# Altium schematic sheet 15_LCD.SchDoc
size A4
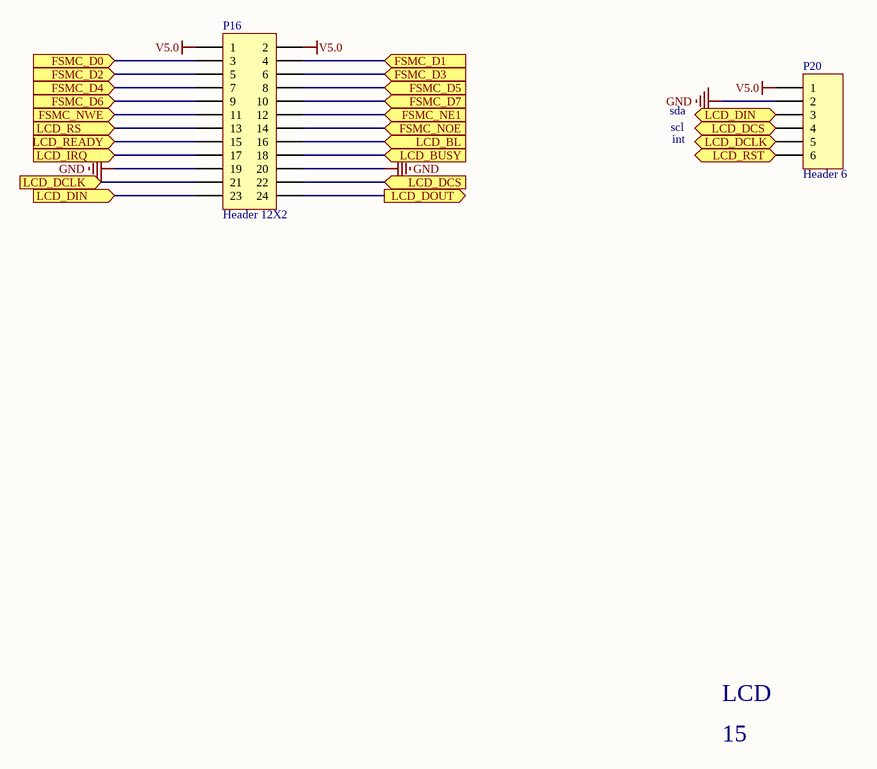
[diagram p0: 15_LCD.SchDoc]

## Parts
P16  Header 12X2  [HDR2X12]
P20  Header 6  [HDR1X6]

## Ports
FSMC_D0 (in), FSMC_D1 (in), FSMC_D2 (in), FSMC_D3 (in), FSMC_D4 (in), FSMC_D5 (in), FSMC_D6 (in), FSMC_D7 (in), FSMC_NE1 (in), FSMC_NOE (in), FSMC_NWE (in), LCD_BL (in), LCD_BUSY (in), LCD_DCLK (in), LCD_DCS (in), LCD_DIN (in), LCD_DOUT (out), LCD_IRQ (in), LCD_READY (in), LCD_RS (in), LCD_RST (in)

## Nets
GND: P16.19 P16.20 P20.2
V5.0: P16.1 P16.2 P20.1
FSMC_D0: P16.3 ; port FSMC_D0
FSMC_D1: P16.4 ; port FSMC_D1
FSMC_D2: P16.5 ; port FSMC_D2
FSMC_D3: P16.6 ; port FSMC_D3
FSMC_D4: P16.7 ; port FSMC_D4
FSMC_D5: P16.8 ; port FSMC_D5
FSMC_D6: P16.9 ; port FSMC_D6
FSMC_D7: P16.10 ; port FSMC_D7
FSMC_NE1: P16.12 ; port FSMC_NE1
FSMC_NOE: P16.14 ; port FSMC_NOE
FSMC_NWE: P16.11 ; port FSMC_NWE
LCD_BL: P16.16 ; port LCD_BL
LCD_BUSY: P16.18 ; port LCD_BUSY
LCD_DCLK: P16.21 P20.5 ; port LCD_DCLK
LCD_DCS: P16.22 P20.4 ; port LCD_DCS
LCD_DIN: P16.23 P20.3 ; port LCD_DIN
LCD_DOUT: P16.24 ; port LCD_DOUT
LCD_IRQ: P16.17 ; port LCD_IRQ
LCD_READY: P16.15 ; port LCD_READY
LCD_RS: P16.13 ; port LCD_RS
LCD_RST: P20.6 ; port LCD_RST

## Notes on the sheet
- sda
- scl
- int
- LCD
- 15

## Library data of the parts
P16 = Header 12X2: Header, 12-Pin, Dual row; LatestRevisionDate: 17-Jul-2002; LatestRevisionNote: Re-released for DXP Platform.; Publisher: Altium Limited
P20 = Header 6: Header, 6-Pin; LatestRevisionDate: 17-Jul-2002; LatestRevisionNote: Re-released for DXP Platform.; Publisher: Altium Limited